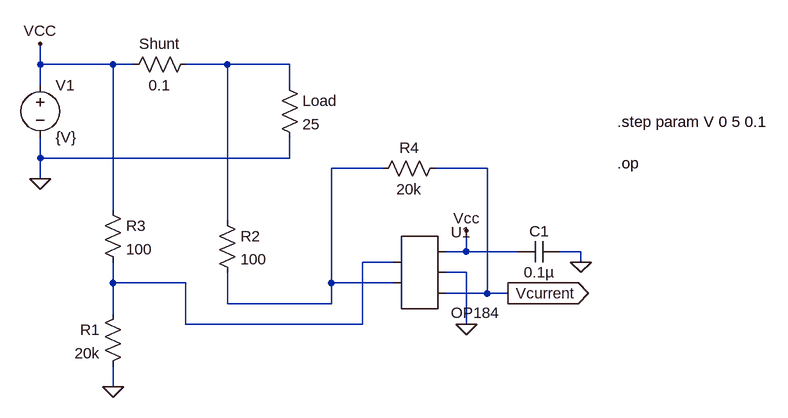
[diagram p0: schematic dechargeBatterie.asc]
* dechargeBatterie.asc
R§Shunt N001 Vcc 0.1
V1 Vcc 0 {V}
R§Load N001 0 25
C1 0 Vcc 0.1µ
R1 N003 0 20k
R2 N001 N002 100
R3 Vcc N003 100
R4 Vcurrent N002 20k
* U1: OP184 (symbol AutoGenerated\OP184 not available, pins judged from their places): pin1=N003 pin2=N002 pin3=Vcc pin4=0 pin5=Vcurrent
.op
.step param V 0 5 0.1
.backanno
.end

* Results of the author's LTspice run, read from the files saved beside the schematic
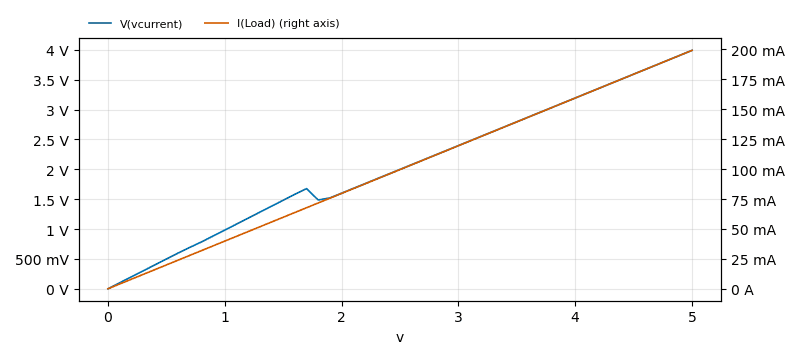
[diagram p1: Operating Point of dechargeBatterie.asc, plotted from the saved traces]
* Operating Point, 1 run:
*   V(vcurrent): -515 nV at v=0, 3.991 V at v=5 , min -515 nV, max 3.991 V
*   I(Load): -19.92 pA at v=0, 199.2 mA at v=5 , min -19.92 pA, max 199.2 mA